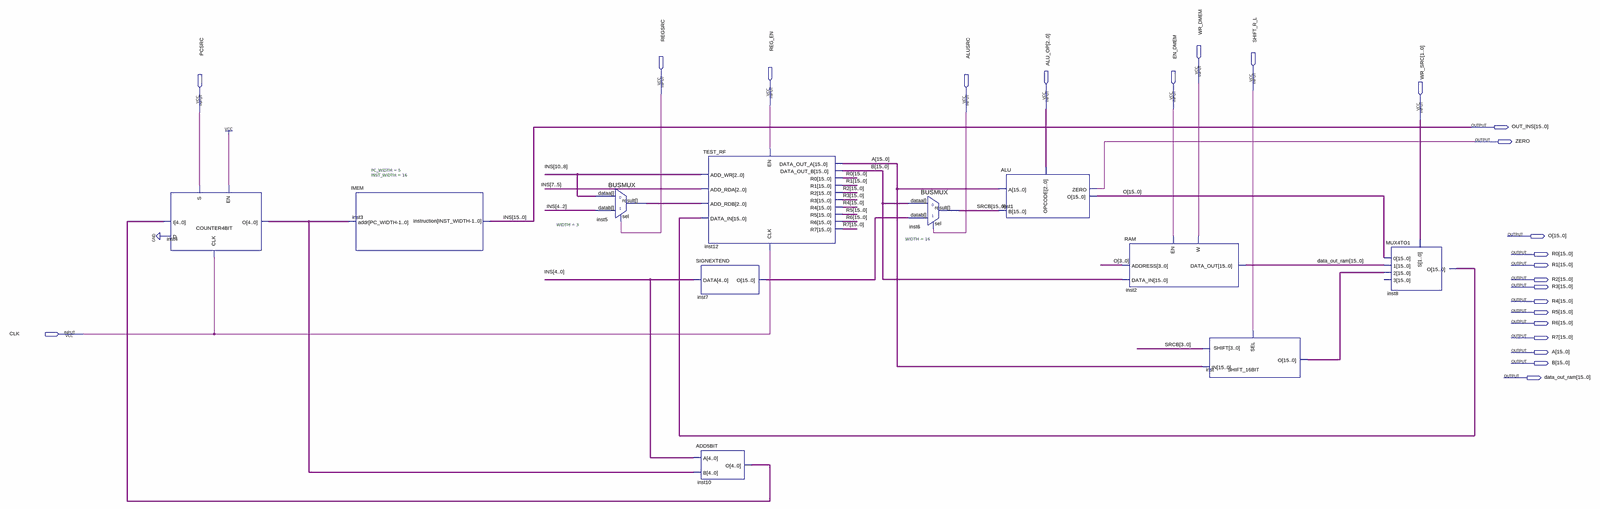
[diagram p0: schematic sheet, whole]
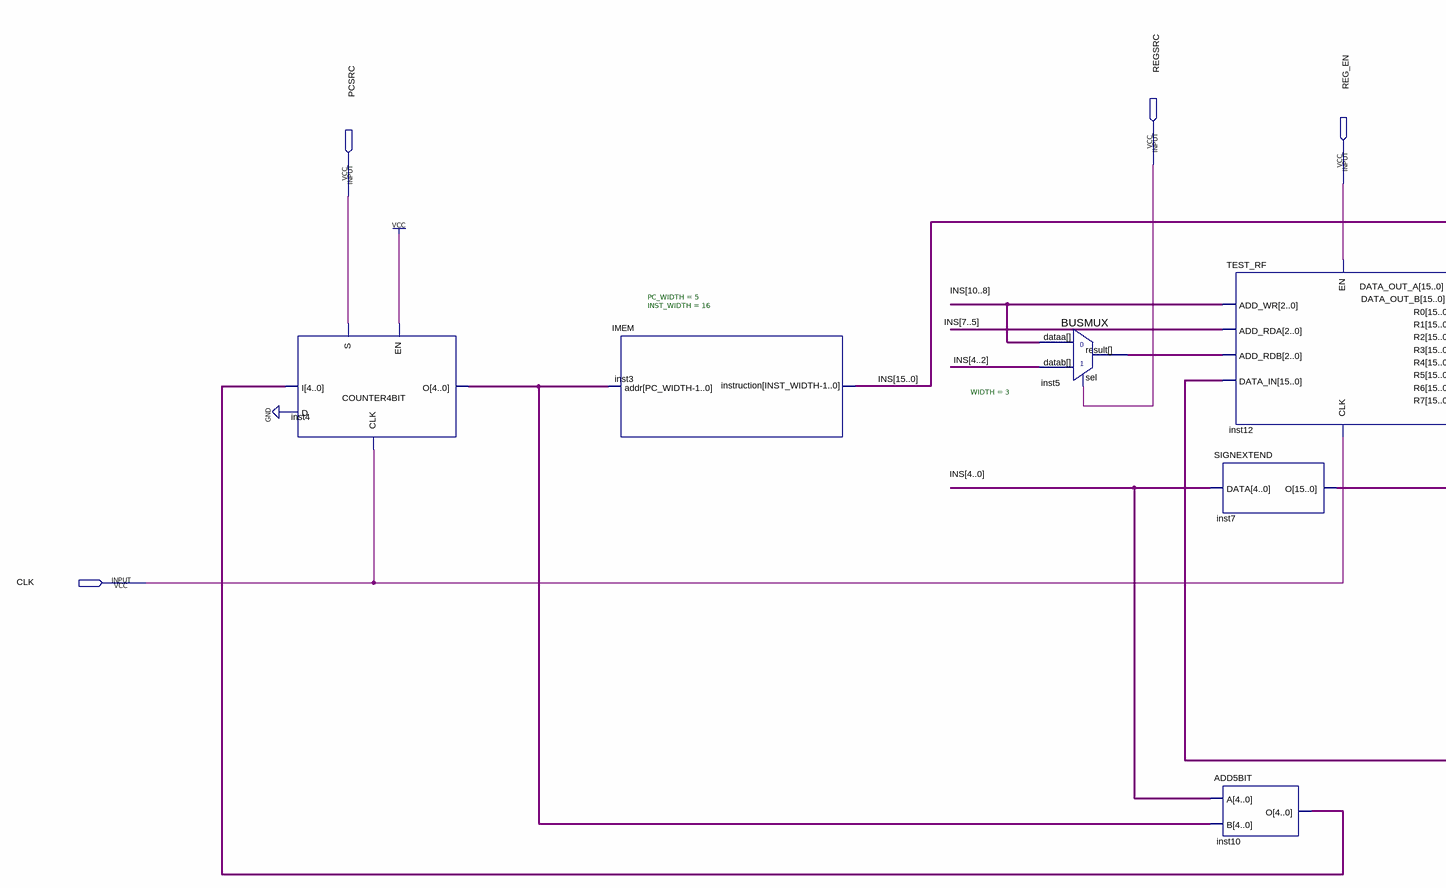
[diagram p1: schematic sheet, left part]
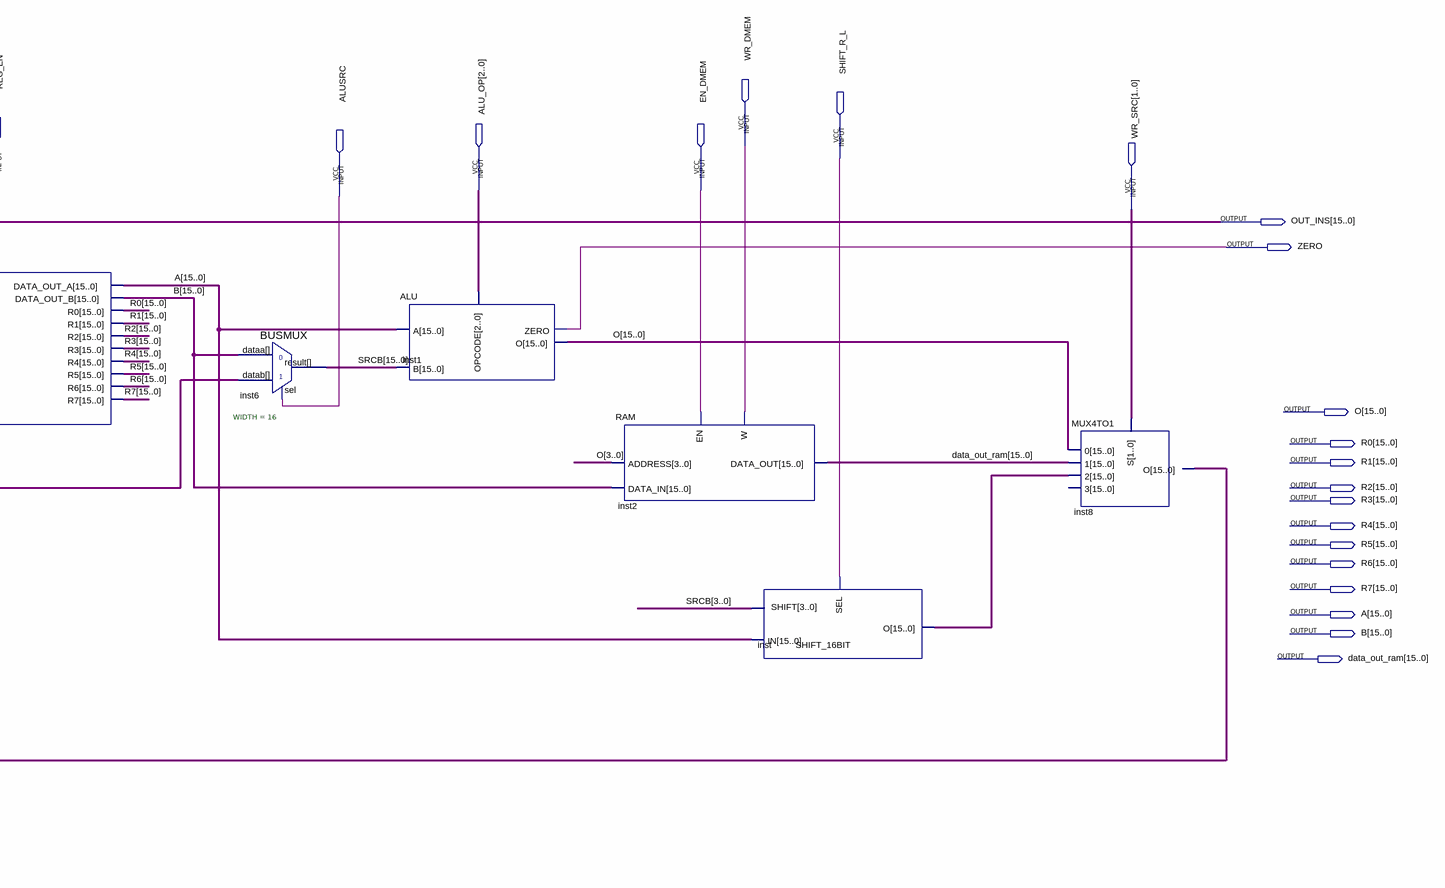
[diagram p2: schematic sheet, right part]
// Quartus schematic TEST_DP.bdf as structural Verilog: 11 symbols, 24 pins
module TEST_DP (
  input  WR_DMEM,
  input  SHIFT_R_L,
  input  REGSRC,
  input  REG_EN,
  input  [2:0] ALU_OP,
  input  EN_DMEM,
  input  PCSRC,
  input  ALUSRC,
  input  [1:0] WR_SRC,
  input  CLK,
  output [15:0] OUT_INS,
  output ZERO,
  output [15:0] O,
  output [15:0] R0,
  output [15:0] R1,
  output [15:0] R2,
  output [15:0] R3,
  output [15:0] R4,
  output [15:0] R5,
  output [15:0] R6,
  output [15:0] R7,
  output [15:0] A,
  output [15:0] B,
  output [15:0] data_out_ram
);

  wire [2:0] inst5_result;
  wire [4:0] inst4_o, inst10_o;
  wire [15:0] inst7_o, inst8_o, inst_o, SRCB;

  COUNTER4BIT inst4 (.I(inst10_o), .S(PCSRC), .EN(1'b1), .D(1'b0), .CLK(CLK), .O(inst4_o));
  IMEM #(.PC_WIDTH(5), .INST_WIDTH(16)) inst3 (.addr(inst4_o), .instruction(OUT_INS));
  BUSMUX #(.WIDTH(3)) inst5 (.datab(OUT_INS[4:2]), .sel(REGSRC), .dataa(OUT_INS[10:8]), .result(inst5_result));
  TEST_RF inst12 (
    .DATA_IN(inst8_o), .ADD_RDA(OUT_INS[7:5]), .ADD_RDB(inst5_result), .ADD_WR(OUT_INS[10:8]), .EN(REG_EN),
    .CLK(CLK), .DATA_OUT_A(A), .DATA_OUT_B(B), .R0(R0), .R1(R1), .R2(R2), .R3(R3), .R4(R4), .R5(R5), .R6(R6),
    .R7(R7));
  SIGNEXTEND inst7 (.DATA(OUT_INS[4:0]), .O(inst7_o));
  ADD5BIT inst10 (.A(OUT_INS[4:0]), .B(inst4_o), .O(inst10_o));
  BUSMUX #(.WIDTH(16)) inst6 (.datab(inst7_o), .sel(ALUSRC), .dataa(B), .result(SRCB));
  ALU inst1 (.OPCODE(ALU_OP), .A(A), .B(SRCB), .O(O), .ZERO(ZERO));
  RAM inst2 (.DATA_IN(B), .W(WR_DMEM), .ADDRESS(O[3:0]), .EN(EN_DMEM), .DATA_OUT(data_out_ram));
  SHIFT_16BIT inst (.SEL(SHIFT_R_L), .SHIFT(SRCB[3:0]), .IN(A), .O(inst_o));
  MUX4TO1 inst8 (.\0 (O), .\1 (data_out_ram), .\2 (inst_o), .S(WR_SRC), .O(inst8_o));  // open: 3

  // Other names for the same wires on the sheet: INS[15:0] = OUT_INS
endmodule
